# Altium project Send_Medicine_Motor.PrjPcb
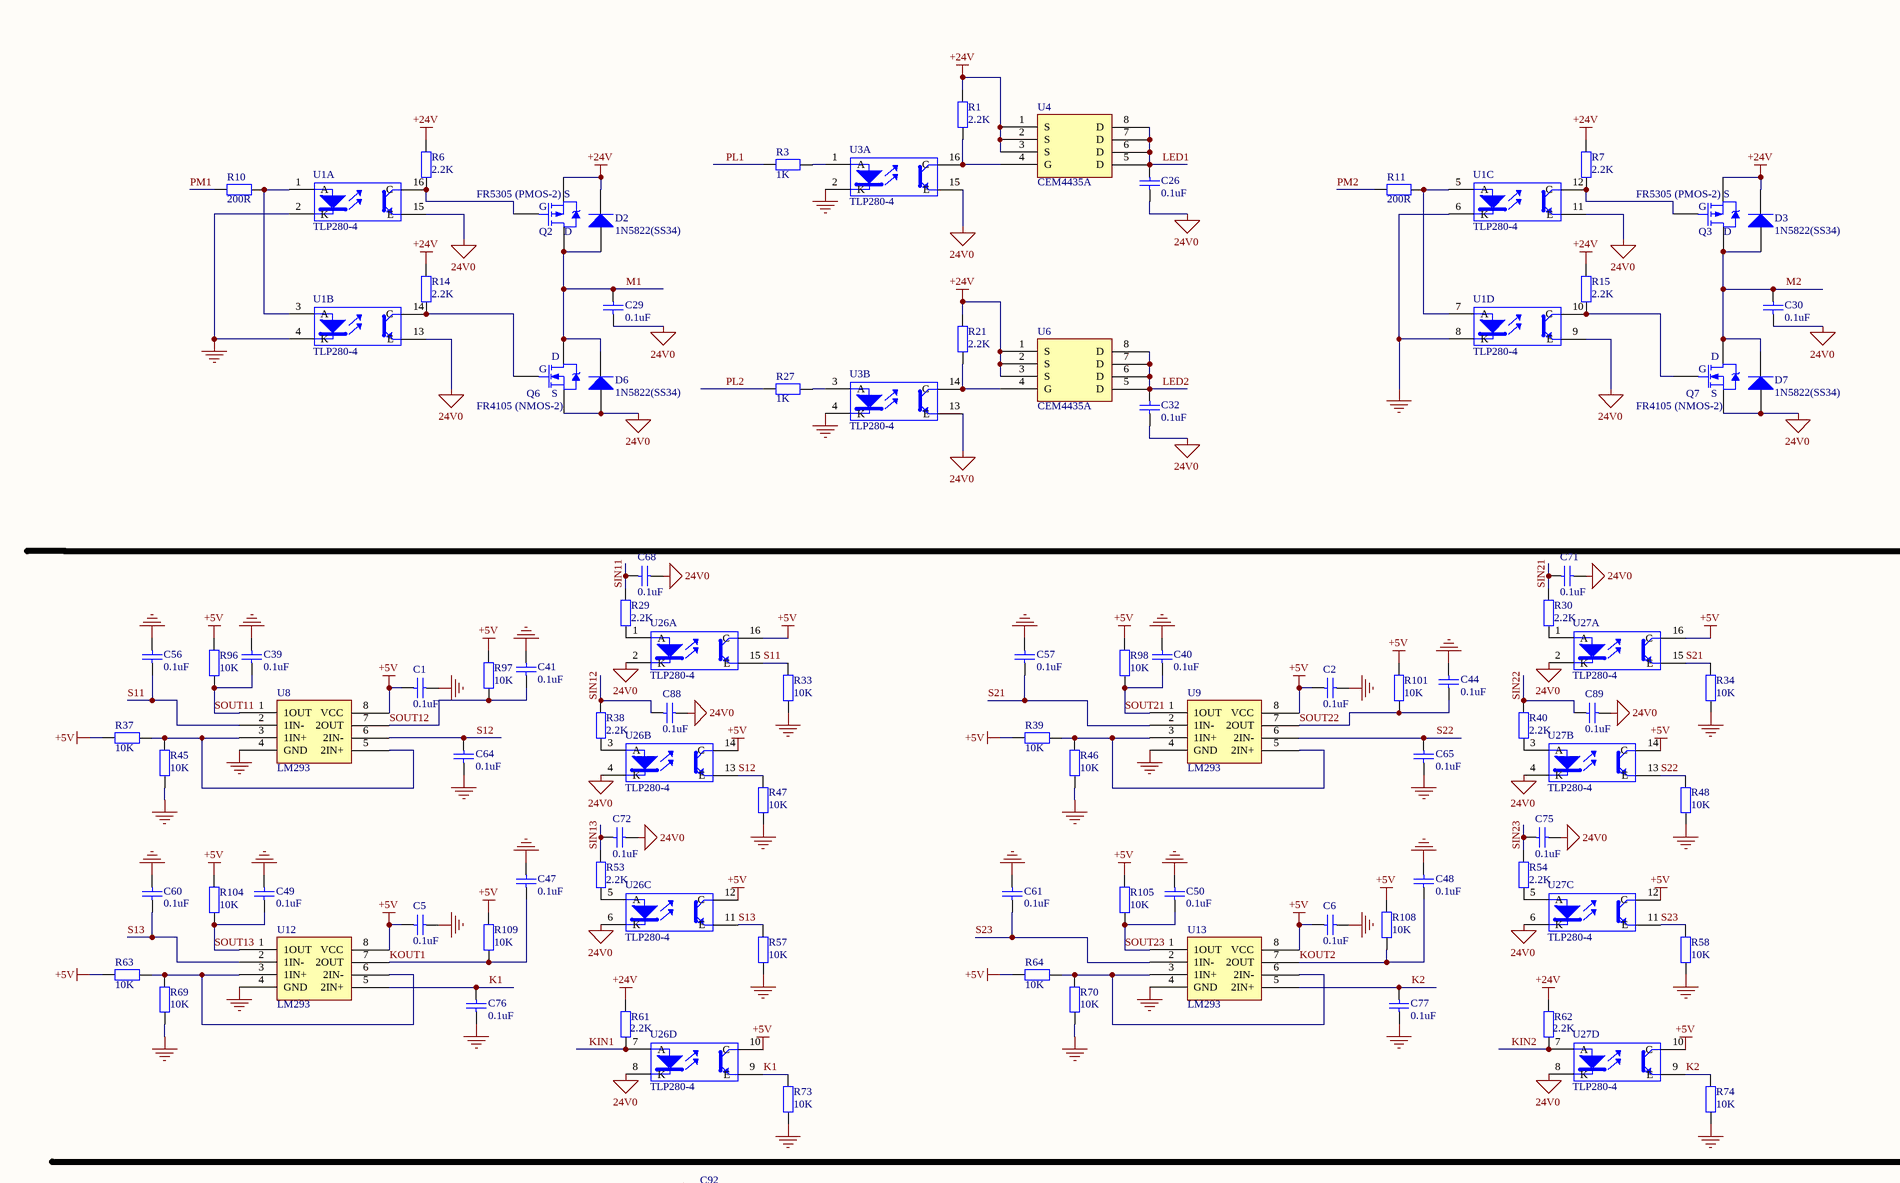
[diagram p0: Send_Medicine_Motor.SchDoc, top left]
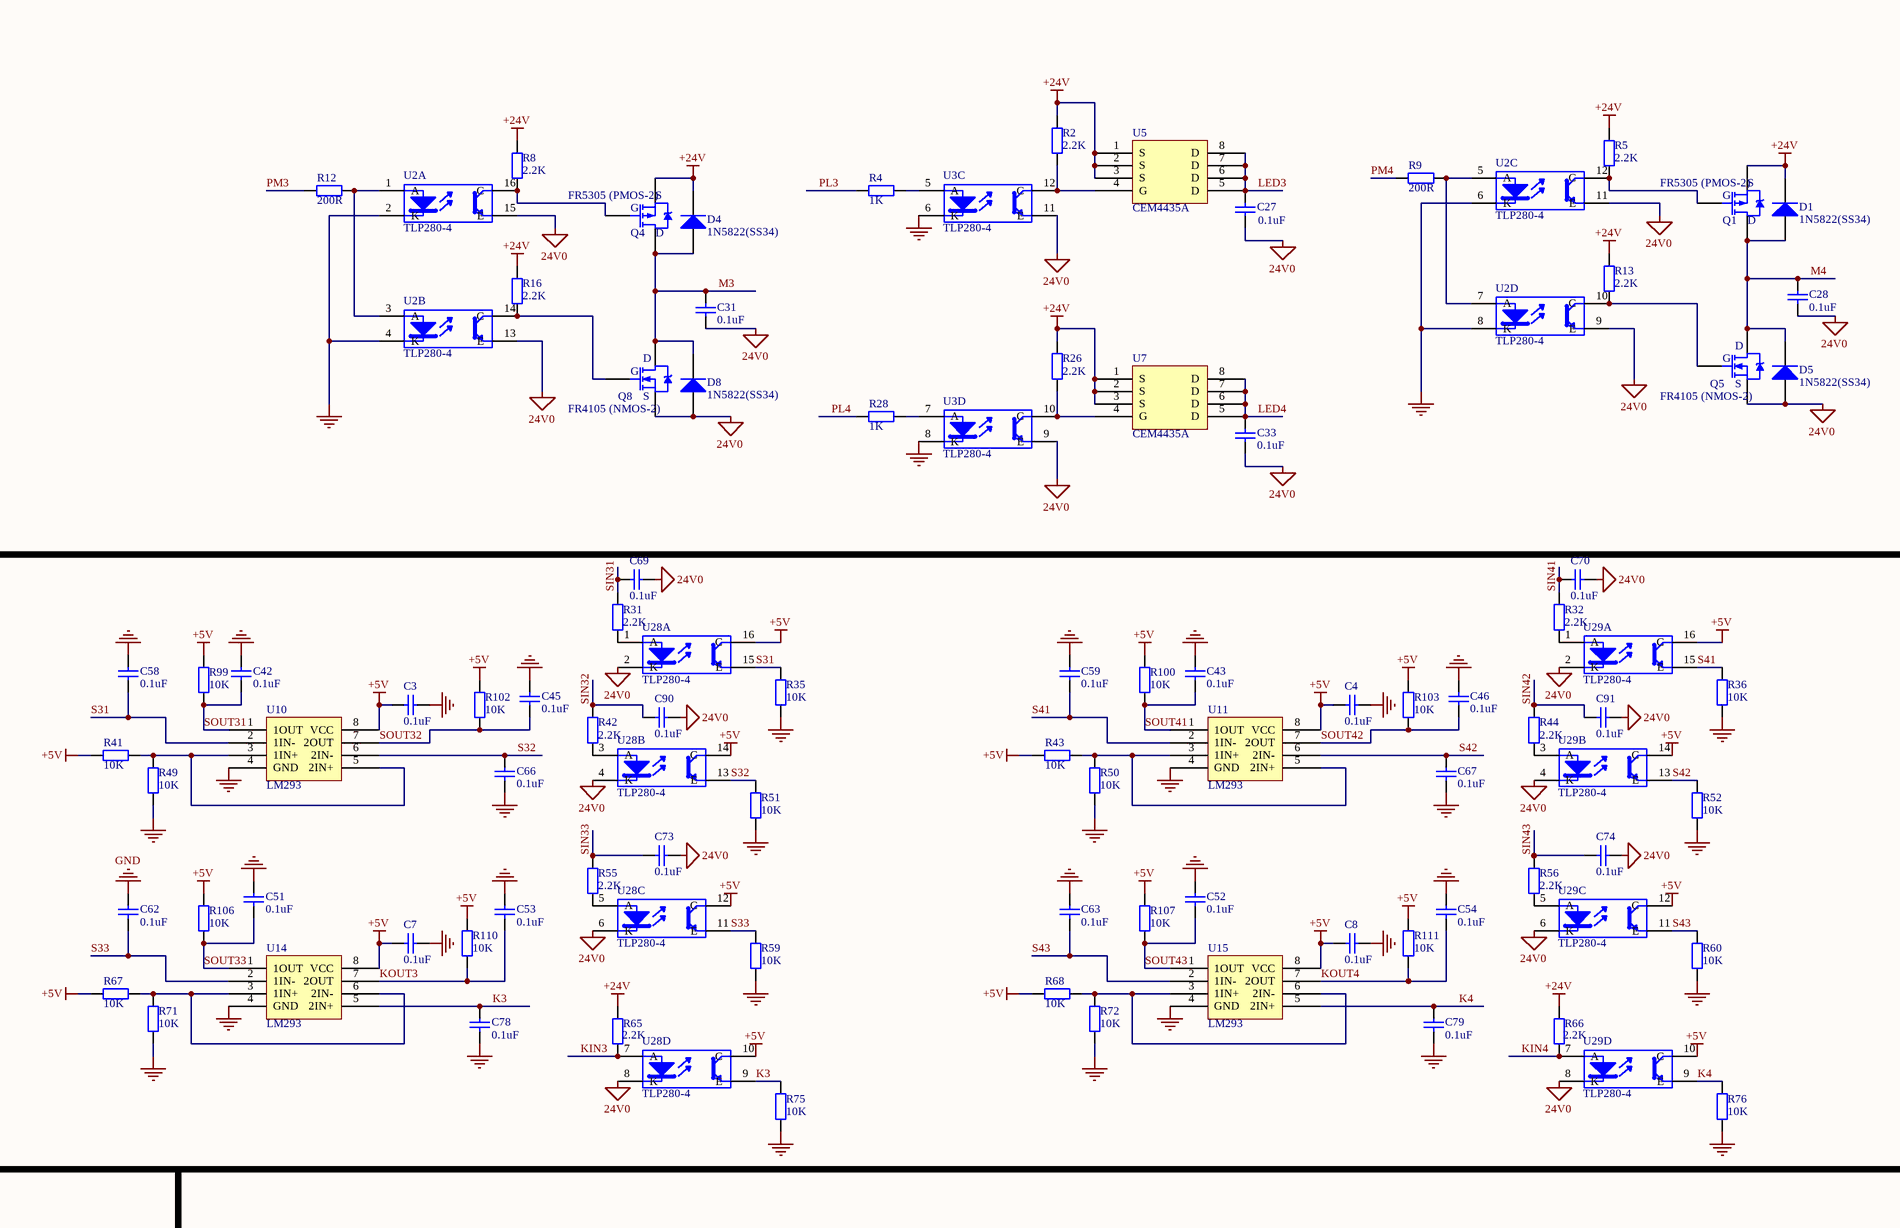
[diagram p1: Send_Medicine_Motor.SchDoc, top middle]
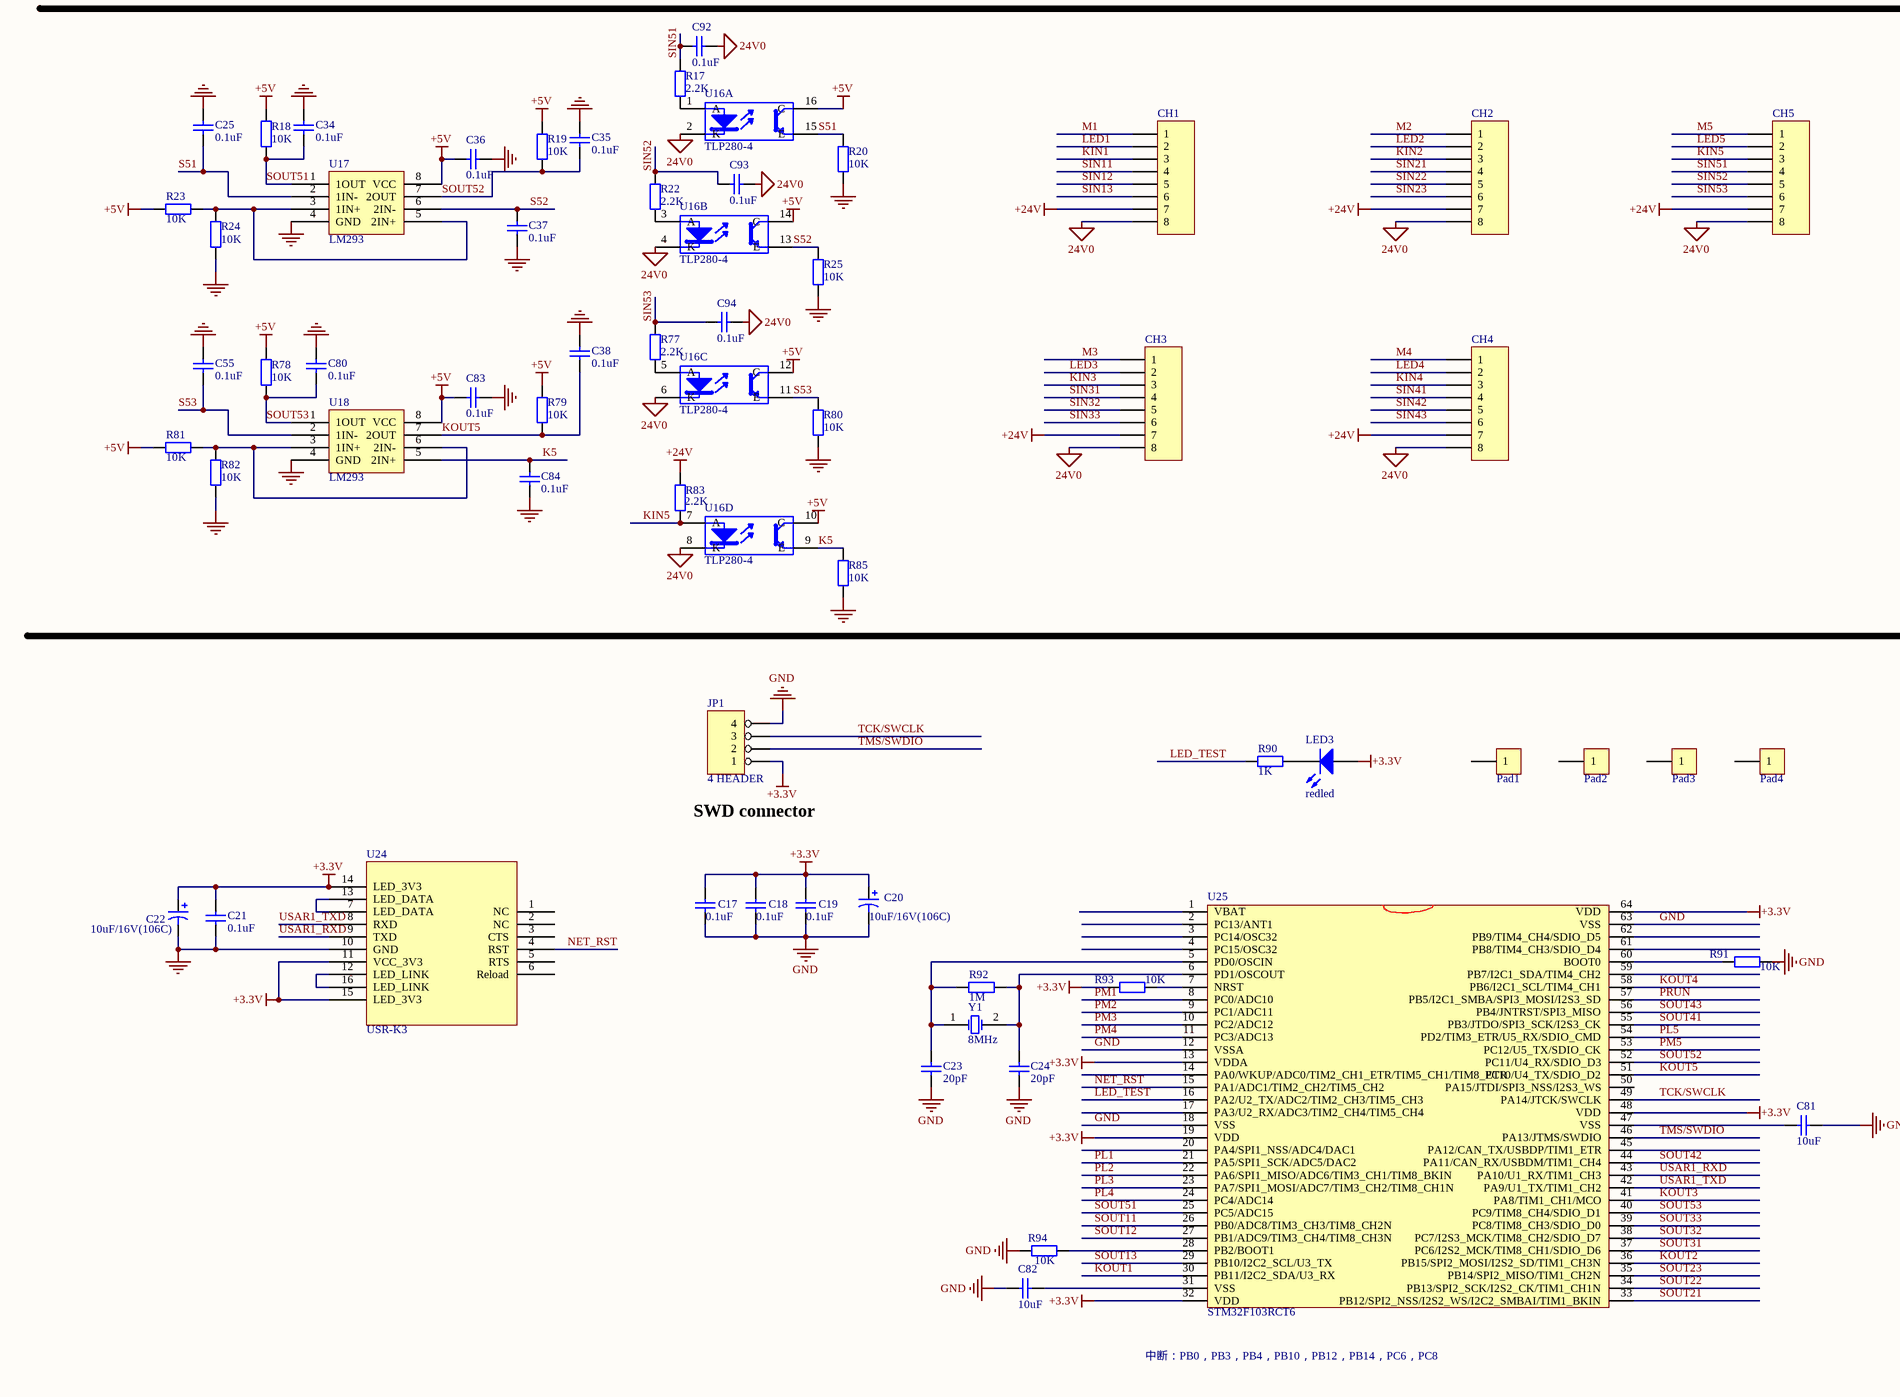
[diagram p2: Send_Medicine_Motor.SchDoc, bottom left]
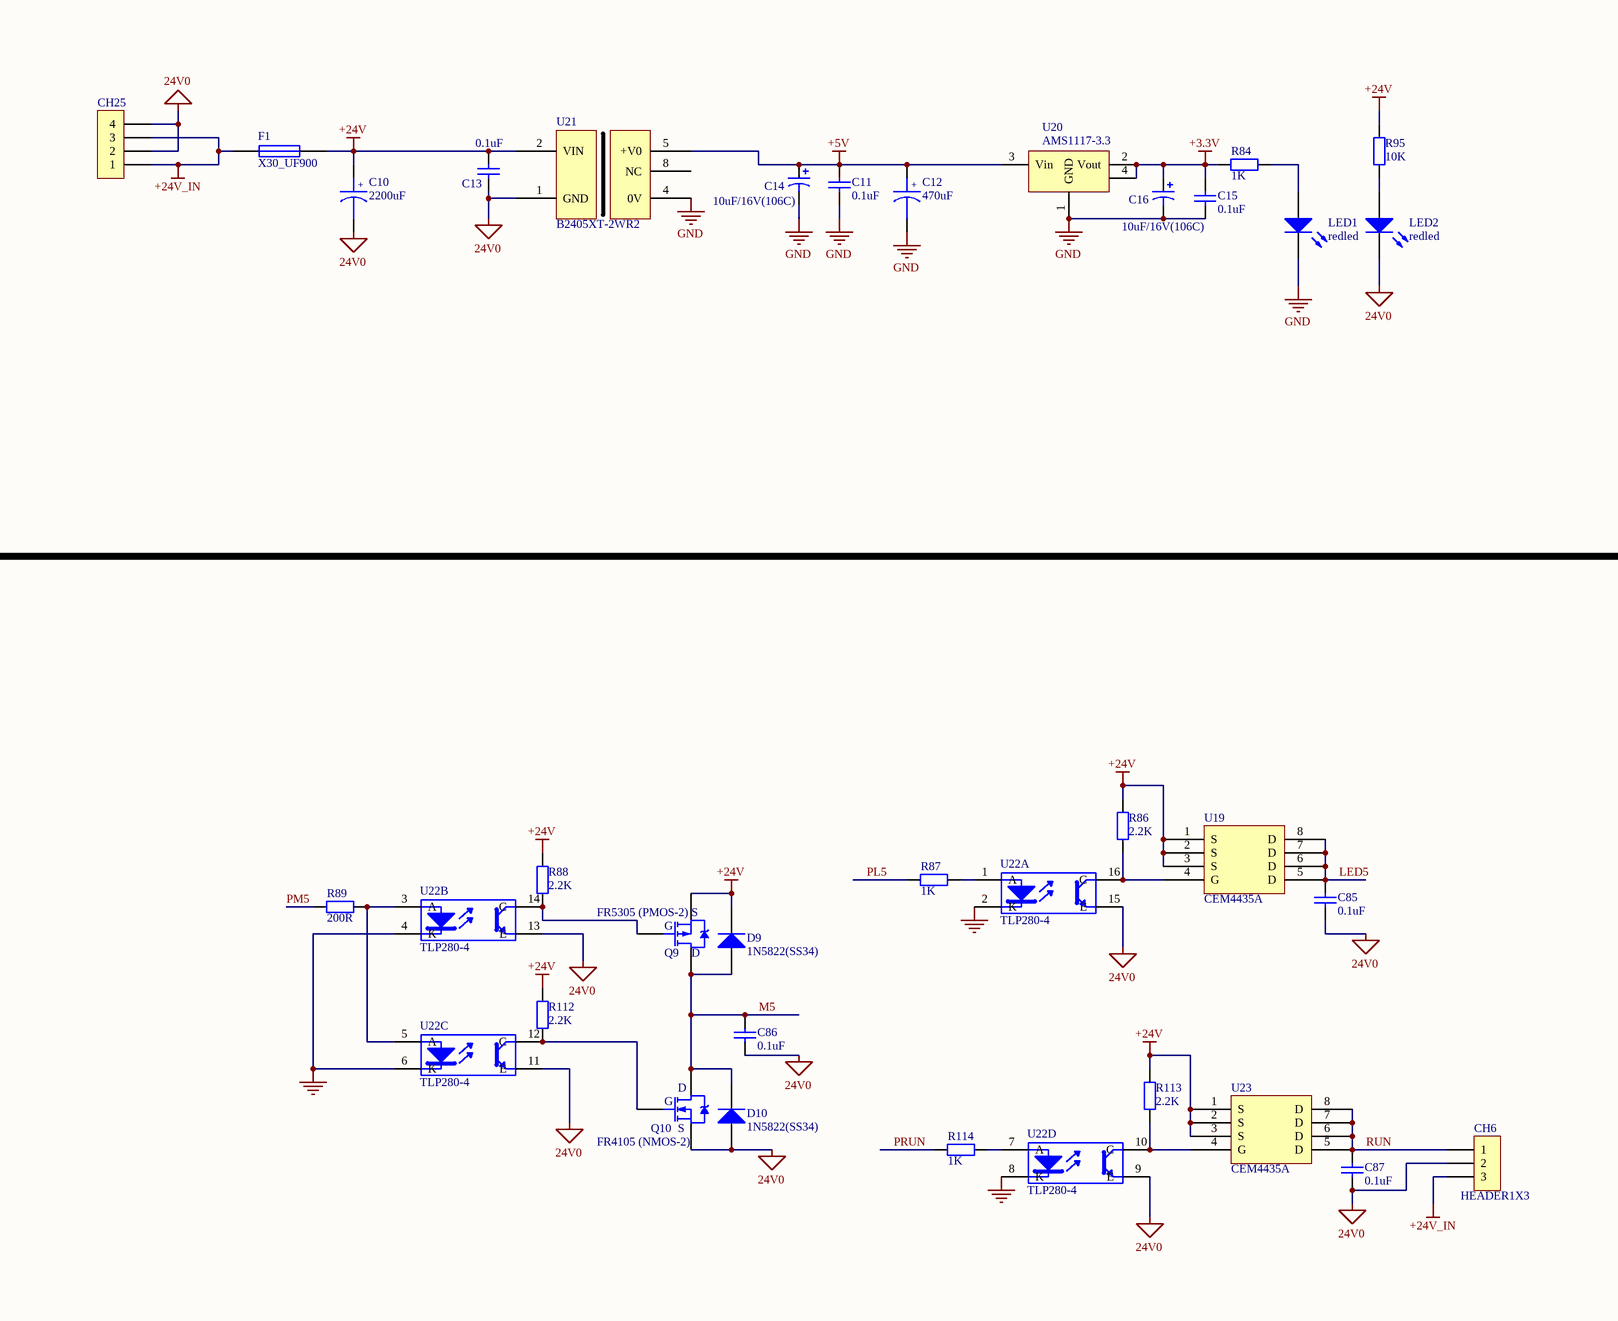
[diagram p3: Send_Medicine_Motor.SchDoc, bottom middle]
1 sheet, 273 parts. Net scope: global (net labels, ports and power ports of the same name join across sheets).
Board file: Send_Medicine_Motor.PcbDoc

## Sheet Send_Medicine_Motor.SchDoc
size A1

### Parts
C1  0.1uF  [0805]
C2  0.1uF  [0805]
C3  0.1uF  [0805]
C4  0.1uF  [0805]
C5  0.1uF  [0805]
C6  0.1uF  [0805]
C7  0.1uF  [0805]
C8  0.1uF  [0805]
C10  2200uF  [C7.8*17]
C11  0.1uF  [0805]
C12  470uF  [C5*10]
C13  0.1uF  [0805]
C14  10uF/16V(106C)  [CAP A-3216]
C15  0.1uF  [0805]
C16  10uF/16V(106C)  [CAP A-3216]
C17  0.1uF  [0805]
C18  0.1uF  [0805]
C19  0.1uF  [0805]
C20  10uF/16V(106C)  [CAP A-3216]
C21  0.1uF  [0805]
C22  10uF/16V(106C)  [CAP A-3216]
C23  20pF  [0805]
C24  20pF  [0805]
C25  0.1uF  [0805]
C26  0.1uF  [0805]
C27  0.1uF  [0805]
C28  0.1uF  [0805]
C29  0.1uF  [0805]
C30  0.1uF  [0805]
C31  0.1uF  [0805]
C32  0.1uF  [0805]
C33  0.1uF  [0805]
C34  0.1uF  [0805]
C35  0.1uF  [0805]
C36  0.1uF  [0805]
C37  0.1uF  [0805]
C38  0.1uF  [0805]
C39  0.1uF  [0805]
C40  0.1uF  [0805]
C41  0.1uF  [0805]
C42  0.1uF  [0805]
C43  0.1uF  [0805]
C44  0.1uF  [0805]
C45  0.1uF  [0805]
C46  0.1uF  [0805]
C47  0.1uF  [0805]
C48  0.1uF  [0805]
C49  0.1uF  [0805]
C50  0.1uF  [0805]
C51  0.1uF  [0805]
C52  0.1uF  [0805]
C53  0.1uF  [0805]
C54  0.1uF  [0805]
C55  0.1uF  [0805]
C56  0.1uF  [0805]
C57  0.1uF  [0805]
C58  0.1uF  [0805]
C59  0.1uF  [0805]
C60  0.1uF  [0805]
C61  0.1uF  [0805]
C62  0.1uF  [0805]
C63  0.1uF  [0805]
C64  0.1uF  [0805]
C65  0.1uF  [0805]
C66  0.1uF  [0805]
C67  0.1uF  [0805]
C68  0.1uF  [0805]
C69  0.1uF  [0805]
C70  0.1uF  [0805]
C71  0.1uF  [0805]
C72  0.1uF  [0805]
C73  0.1uF  [0805]
C74  0.1uF  [0805]
C75  0.1uF  [0805]
C76  0.1uF  [0805]
C77  0.1uF  [0805]
C78  0.1uF  [0805]
C79  0.1uF  [0805]
C80  0.1uF  [0805]
C81  10uF  [0805]
C82  10uF  [0805]
C83  0.1uF  [0805]
C84  0.1uF  [0805]
C85  0.1uF  [0805]
C86  0.1uF  [0805]
C87  0.1uF  [0805]
C88  0.1uF  [0805]
C89  0.1uF  [0805]
C90  0.1uF  [0805]
C91  0.1uF  [0805]
C92  0.1uF  [0805]
C93  0.1uF  [0805]
C94  0.1uF  [0805]
CH1  HEADER1X8  [CH3.96-8PIN]  (value not drawn)
CH2  HEADER1X8  [CH3.96-8PIN]  (value not drawn)
CH3  HEADER1X8  [CH3.96-8PIN]  (value not drawn)
CH4  HEADER1X8  [CH3.96-8PIN]  (value not drawn)
CH5  HEADER1X8  [CH3.96-8PIN]  (value not drawn)
CH6  HEADER1X3  [CH3.96-3PIN]
CH25  HEADER1X4  [CH3.96-4PIN]  (value not drawn)
D1  1N5822(SS34)  [SMA]
D2  1N5822(SS34)  [SMA]
D3  1N5822(SS34)  [SMA]
D4  1N5822(SS34)  [SMA]
D5  1N5822(SS34)  [SMA]
D6  1N5822(SS34)  [SMA]
D7  1N5822(SS34)  [SMA]
D8  1N5822(SS34)  [SMA]
D9  1N5822(SS34)  [SMA]
D10  1N5822(SS34)  [SMA]
F1  X30_UF900  [X30UF900]
JP1  4 HEADER  [CON4_1.5]
LED1  redled  [LED-0805]
LED2  redled  [LED-0805]
LED3  redled  [LED-0805]
Pad1  Pad  [pad35]  (value not drawn)
Pad2  Pad  [pad35]  (value not drawn)
Pad3  Pad  [pad35]  (value not drawn)
Pad4  Pad  [pad35]  (value not drawn)
Q1  FR5305 (PMOS-2)  [TO-252]
Q2  FR5305 (PMOS-2)  [TO-252]
Q3  FR5305 (PMOS-2)  [TO-252]
Q4  FR5305 (PMOS-2)  [TO-252]
Q5  FR4105 (NMOS-2)  [TO-252]
Q6  FR4105 (NMOS-2)  [TO-252]
Q7  FR4105 (NMOS-2)  [TO-252]
Q8  FR4105 (NMOS-2)  [TO-252]
Q9  FR5305 (PMOS-2)  [TO-252]
Q10  FR4105 (NMOS-2)  [TO-252]
R1  2.2K  [0805]
R2  2.2K  [0805]
R3  1K  [0805]
R4  1K  [0805]
R5  2.2K  [0805]
R6  2.2K  [0805]
R7  2.2K  [0805]
R8  2.2K  [0805]
R9  200R  [0805]
R10  200R  [0805]
R11  200R  [0805]
R12  200R  [0805]
R13  2.2K  [0805]
R14  2.2K  [0805]
R15  2.2K  [0805]
R16  2.2K  [0805]
R17  2.2K  [0805]
R18  10K  [0805]
R19  10K  [0805]
R20  10K  [0805]
R21  2.2K  [0805]
R22  2.2K  [0805]
R23  10K  [0805]
R24  10K  [0805]
R25  10K  [0805]
R26  2.2K  [0805]
R27  1K  [0805]
R28  1K  [0805]
R29  2.2K  [0805]
R30  2.2K  [0805]
R31  2.2K  [0805]
R32  2.2K  [0805]
R33  10K  [0805]
R34  10K  [0805]
R35  10K  [0805]
R36  10K  [0805]
R37  10K  [0805]
R38  2.2K  [0805]
R39  10K  [0805]
R40  2.2K  [0805]
R41  10K  [0805]
R42  2.2K  [0805]
R43  10K  [0805]
R44  2.2K  [0805]
R45  10K  [0805]
R46  10K  [0805]
R47  10K  [0805]
R48  10K  [0805]
R49  10K  [0805]
R50  10K  [0805]
R51  10K  [0805]
R52  10K  [0805]
R53  2.2K  [0805]
R54  2.2K  [0805]
R55  2.2K  [0805]
R56  2.2K  [0805]
R57  10K  [0805]
R58  10K  [0805]
R59  10K  [0805]
R60  10K  [0805]
R61  2.2K  [0805]
R62  2.2K  [0805]
R63  10K  [0805]
R64  10K  [0805]
R65  2.2K  [0805]
R66  2.2K  [0805]
R67  10K  [0805]
R68  10K  [0805]
R69  10K  [0805]
R70  10K  [0805]
R71  10K  [0805]
R72  10K  [0805]
R73  10K  [0805]
R74  10K  [0805]
R75  10K  [0805]
R76  10K  [0805]
R77  2.2K  [0805]
R78  10K  [0805]
R79  10K  [0805]
R80  10K  [0805]
R81  10K  [0805]
R82  10K  [0805]
R83  2.2K  [0805]
R84  1K  [0805]
R85  10K  [0805]
R86  2.2K  [0805]
R87  1K  [0805]
R88  2.2K  [0805]
R89  200R  [0805]
R90  1K  [0805]
R91  10K  [0805]
R92  1M  [0805]
R93  10K  [0805]
R94  10K  [0805]
R95  10K  [0805]
R96  10K  [0805]
R97  10K  [0805]
R98  10K  [0805]
R99  10K  [0805]
R100  10K  [0805]
R101  10K  [0805]
R102  10K  [0805]
R103  10K  [0805]
R104  10K  [0805]
R105  10K  [0805]
R106  10K  [0805]
R107  10K  [0805]
R108  10K  [0805]
R109  10K  [0805]
R110  10K  [0805]
R111  10K  [0805]
R112  2.2K  [0805]
R113  2.2K  [0805]
R114  1K  [0805]
U1  TLP280-4  [SO16]  (parts A,B,C,D of 4)
U2  TLP280-4  [SO16]  (parts A,B,C,D of 4)
U3  TLP280-4  [SO16]  (parts A,B,C,D of 4)
U4  CEM4435A  [SOP8-OP27]
U5  CEM4435A  [SOP8-OP27]
U6  CEM4435A  [SOP8-OP27]
U7  CEM4435A  [SOP8-OP27]
U8  LM293  [SOP8-OP27]
U9  LM293  [SOP8-OP27]
U10  LM293  [SOP8-OP27]
U11  LM293  [SOP8-OP27]
U12  LM293  [SOP8-OP27]
U13  LM293  [SOP8-OP27]
U14  LM293  [SOP8-OP27]
U15  LM293  [SOP8-OP27]
U16  TLP280-4  [SO16]  (parts A,B,C,D of 4)
U17  LM293  [SOP8-OP27]
U18  LM293  [SOP8-OP27]
U19  CEM4435A  [SOP8-OP27]
U20  AMS1117-3.3  [SOT223]
U21  B2405XT-2WR2  [B2405XT-2WR2]
U22  TLP280-4  [SO16]  (parts A,B,C,D of 4)
U23  CEM4435A  [SOP8-OP27]
U24  USR-K3  [USR-K3]
U25  STM32F103RCT6  [LQFP64]
U26  TLP280-4  [SO16]  (parts A,B,C,D of 4)
U27  TLP280-4  [SO16]  (parts A,B,C,D of 4)
U28  TLP280-4  [SO16]  (parts A,B,C,D of 4)
U29  TLP280-4  [SO16]  (parts A,B,C,D of 4)
Y1  8MHz  [XTAL_US]

### Nets
24V0: C10.2 C13.1 C26.2 C27.2 C28.2 C29.2 C30.2 C31.2 C32.2 C33.2 C68.1 C69.2 C70.2 C71.2 C72.1 C73.2 C74.2 C75.2 C85.2 C86.2 C87.2 C88.1 C89.1 C90.1 C91.1 C92.1 C93.1 C94.1 CH1.8 CH2.8 CH3.8 CH4.8 CH5.8 CH6.2 CH25.2 CH25.4 D5.1(A) D6.1(A) D7.1(A) D8.1(A) D10.1(A) LED2.2(K) Q5.3(S) Q6.3(S) Q7.3(S) Q8.3(S) Q10.3(S) U1.9(E) U1.11(E) U1.13(E) U1.15(E) U2.9(E) U2.11(E) U2.13(E) U2.15(E) U3.9(E) U3.11(E) U3.13(E) U3.15(E) U16.2(K) U16.4(K) U16.6(K) U16.8(K) U21.1(GND) U22.9(E) U22.11(E) U22.13(E) U22.15(E) U26.2(K) U26.4(K) U26.6(K) U26.8(K) U27.2(K) U27.4(K) U27.6(K) U27.8(K) U28.2(K) U28.4(K) U28.6(K) U28.8(K) U29.2(K) U29.4(K) U29.6(K) U29.8(K)
+3.3V: C15.2 C16.1 C17.2 C18.2 C19.2 C20.1 C21.2 C22.1 JP1.1 LED3.1(A) R84.2 R93.1 U20.2(Vout) U20.4 U24.11(VCC_3V3) U24.14(LED_3V3) U24.15(LED_3V3) U25.13(VDDA) U25.19(VDD) U25.32(VDD) U25.48(VDD) U25.64(VDD)
+5V: C1.2 C2.2 C3.2 C4.2 C5.2 C6.2 C7.2 C8.2 C11.2 C12.1 C14.1 C36.2 C83.2 R18.1 R19.1 R23.1 R37.1 R39.1 R41.1 R43.1 R63.1 R64.1 R67.1 R68.1 R78.1 R79.1 R81.1 R96.1 R97.1 R98.1 R99.1 R100.1 R101.1 R102.1 R103.1 R104.1 R105.1 R106.1 R107.1 R108.1 R109.1 R110.1 R111.1 U8.8(VCC) U9.8(VCC) U10.8(VCC) U11.8(VCC) U12.8(VCC) U13.8(VCC) U14.8(VCC) U15.8(VCC) U16.10(C) U16.12(C) U16.14(C) U16.16(C) U17.8(VCC) U18.8(VCC) U20.3(Vin) U21.5(+V0) U26.10(C) U26.12(C) U26.14(C) U26.16(C) U27.10(C) U27.12(C) U27.14(C) U27.16(C) U28.10(C) U28.12(C) U28.14(C) U28.16(C) U29.10(C) U29.12(C) U29.14(C) U29.16(C)
+24V: C10.1 C13.2 CH1.7 CH2.7 CH3.7 CH4.7 CH5.7 D1.2(K) D2.2(K) D3.2(K) D4.2(K) D9.2(K) F1.2 Q1.3(S) Q2.3(S) Q3.3(S) Q4.3(S) Q9.3(S) R1.2 R2.2 R5.2 R6.2 R7.2 R8.2 R13.2 R14.2 R15.2 R16.2 R21.2 R26.2 R61.1 R62.1 R65.1 R66.1 R83.1 R86.2 R88.2 R95.2 R112.2 R113.2 U4.1(S) U4.2(S) U4.3(S) U5.1(S) U5.2(S) U5.3(S) U6.1(S) U6.2(S) U6.3(S) U7.1(S) U7.2(S) U7.3(S) U19.1(S) U19.2(S) U19.3(S) U21.2(VIN) U23.1(S) U23.2(S) U23.3(S)
+24V_IN: CH6.3 CH25.1 CH25.3 F1.1
GND: C1.1 C2.1 C3.1 C4.1 C5.1 C6.1 C7.1 C8.1 C11.1 C12.2 C14.2 C15.1 C16.2 C17.1 C18.1 C19.1 C20.2 C21.1 C22.2 C23.1 C24.1 C25.1 C34.1 C35.1 C36.1 C37.1 C38.1 C39.1 C40.1 C41.1 C42.1 C43.1 C44.1 C45.1 C46.1 C47.1 C48.1 C49.1 C50.1 C51.1 C52.1 C53.1 C54.1 C55.1 C56.1 C57.1 C58.1 C59.1 C60.1 C61.1 C62.1 C63.1 C64.1 C65.1 C66.1 C67.1 C76.1 C77.1 C78.1 C79.1 C80.1 C81.2 C82.1 C83.1 C84.1 JP1.4 LED1.2(K) R20.2 R24.2 R25.2 R33.2 R34.2 R35.2 R36.2 R45.2 R46.2 R47.2 R48.2 R49.2 R50.2 R51.2 R52.2 R57.2 R58.2 R59.2 R60.2 R69.2 R70.2 R71.2 R72.2 R73.2 R74.2 R75.2 R76.2 R80.2 R82.2 R85.2 R91.1 R94.1 U1.2(K) U1.4(K) U1.6(K) U1.8(K) U2.2(K) U2.4(K) U2.6(K) U2.8(K) U3.2(K) U3.4(K) U3.6(K) U3.8(K) U8.4(GND) U9.4(GND) U10.4(GND) U11.4(GND) U12.4(GND) U13.4(GND) U14.4(GND) U15.4(GND) U17.4(GND) U18.4(GND) U20.1(GND) U21.4(0V) U22.2(K) U22.4(K) U22.6(K) U22.8(K) U24.10(GND) U25.12(VSSA) U25.18(VSS) U25.63(VSS)
K1: C76.2 R73.1 U12.5(2IN+) U26.9(E)
K2: C77.2 R74.1 U13.5(2IN+) U27.9(E)
K3: C78.2 R75.1 U14.5(2IN+) U28.9(E)
K4: C79.2 R76.1 U15.5(2IN+) U29.9(E)
K5: C84.2 R85.1 U16.9(E) U18.5(2IN+)
KIN1: CH1.3 R61.2 U26.7(A)
KIN2: CH2.3 R62.2 U27.7(A)
KIN3: CH3.3 R65.2 U28.7(A)
KIN4: CH4.3 R66.2 U29.7(A)
KIN5: CH5.3 R83.2 U16.7(A)
KOUT1: C47.2 R109.2 U12.7(2OUT) U25.30(PB11/I2C2_SDA/U3_RX)
KOUT2: C48.2 R108.2 U13.7(2OUT) U25.36(PB15/SPI2_MOSI/I2S2_SD/TIM1_CH3N)
KOUT3: C53.2 R110.2 U14.7(2OUT) U25.41(PA8/TIM1_CH1/MCO)
KOUT4: C54.2 R111.2 U15.7(2OUT) U25.58(PB6/I2C1_SCL/TIM4_CH1)
KOUT5: C38.2 R79.2 U18.7(2OUT) U25.51(PC10/U4_TX/SDIO_D2)
LED1: C26.1 CH1.2 U4.5(D) U4.6(D) U4.7(D) U4.8(D)
LED2: C32.1 CH2.2 U6.5(D) U6.6(D) U6.7(D) U6.8(D)
LED3: C27.1 CH3.2 U5.5(D) U5.6(D) U5.7(D) U5.8(D)
LED4: C33.1 CH4.2 U7.5(D) U7.6(D) U7.7(D) U7.8(D)
LED5: C85.1 CH5.2 U19.5(D) U19.6(D) U19.7(D) U19.8(D)
LED_TEST: R90.1 U25.16(PA2/U2_TX/ADC2/TIM2_CH3/TIM5_CH3)
M1: C29.1 CH1.1 D2.1(A) D6.2(K) Q2.2(D) Q6.2(D)
M2: C30.1 CH2.1 D3.1(A) D7.2(K) Q3.2(D) Q7.2(D)
M3: C31.1 CH3.1 D4.1(A) D8.2(K) Q4.2(D) Q8.2(D)
M4: C28.1 CH4.1 D1.1(A) D5.2(K) Q1.2(D) Q5.2(D)
M5: C86.1 CH5.1 D9.1(A) D10.2(K) Q9.2(D) Q10.2(D)
NET_RST: U24.4(RST) U25.15(PA1/ADC1/TIM2_CH2/TIM5_CH2)
PL1: R3.1 U25.21(PA5/SPI1_SCK/ADC5/DAC2)
PL2: R27.1 U25.22(PA6/SPI1_MISO/ADC6/TIM3_CH1/TIM8_BKIN)
PL3: R4.1 U25.23(PA7/SPI1_MOSI/ADC7/TIM3_CH2/TIM8_CH1N)
PL4: R28.1 U25.24(PC4/ADC14)
PL5: R87.1 U25.54(PD2/TIM3_ETR/U5_RX/SDIO_CMD)
PM1: R10.1 U25.8(PC0/ADC10)
PM2: R11.1 U25.9(PC1/ADC11)
PM3: R12.1 U25.10(PC2/ADC12)
PM4: R9.1 U25.11(PC3/ADC13)
PM5: R89.1 U25.53(PC12/U5_TX/SDIO_CK)
PRUN: R114.1 U25.57(PB5/I2C1_SMBA/SPI3_MOSI/I2S3_SD)
RUN: C87.1 CH6.1 U23.5(D) U23.6(D) U23.7(D) U23.8(D)
S11: C56.2 R33.1 U8.2(1IN-) U26.15(E)
S12: C64.2 R47.1 U8.6(2IN-) U26.13(E)
S13: C60.2 R57.1 U12.2(1IN-) U26.11(E)
S21: C57.2 R34.1 U9.2(1IN-) U27.15(E)
S22: C65.2 R48.1 U9.6(2IN-) U27.13(E)
S23: C61.2 R58.1 U13.2(1IN-) U27.11(E)
S31: C58.2 R35.1 U10.2(1IN-) U28.15(E)
S32: C66.2 R51.1 U10.6(2IN-) U28.13(E)
S33: C62.2 R59.1 U14.2(1IN-) U28.11(E)
S41: C59.2 R36.1 U11.2(1IN-) U29.15(E)
S42: C67.2 R52.1 U11.6(2IN-) U29.13(E)
S43: C63.2 R60.1 U15.2(1IN-) U29.11(E)
S51: C25.2 R20.1 U16.15(E) U17.2(1IN-)
S52: C37.2 R25.1 U16.13(E) U17.6(2IN-)
S53: C55.2 R80.1 U16.11(E) U18.2(1IN-)
SIN11: C68.2 CH1.4 R29.1
SIN12: C88.2 CH1.5 R38.1
SIN13: C72.2 CH1.6 R53.1
SIN21: C71.1 CH2.4 R30.1
SIN22: C89.2 CH2.5 R40.1
SIN23: C75.1 CH2.6 R54.1
SIN31: C69.1 CH3.4 R31.1
SIN32: C90.2 CH3.5 R42.1
SIN33: C73.1 CH3.6 R55.1
SIN41: C70.1 CH4.4 R32.1
SIN42: C91.2 CH4.5 R44.1
SIN43: C74.1 CH4.6 R56.1
SIN51: C92.2 CH5.4 R17.1
SIN52: C93.2 CH5.5 R22.1
SIN53: C94.2 CH5.6 R77.1
SOUT11: C39.2 R96.2 U8.1(1OUT) U25.26(PB0/ADC8/TIM3_CH3/TIM8_CH2N)
SOUT12: C41.2 R97.2 U8.7(2OUT) U25.27(PB1/ADC9/TIM3_CH4/TIM8_CH3N)
SOUT13: C49.2 R104.2 U12.1(1OUT) U25.29(PB10/I2C2_SCL/U3_TX)
SOUT21: C40.2 R98.2 U9.1(1OUT) U25.33(PB12/SPI2_NSS/I2S2_WS/I2C2_SMBAI/TIM1_BKIN)
SOUT22: C44.2 R101.2 U9.7(2OUT) U25.34(PB13/SPI2_SCK/I2S2_CK/TIM1_CH1N)
SOUT23: C50.2 R105.2 U13.1(1OUT) U25.35(PB14/SPI2_MISO/TIM1_CH2N)
SOUT31: C42.2 R99.2 U10.1(1OUT) U25.37(PC6/I2S2_MCK/TIM8_CH1/SDIO_D6)
SOUT32: C45.2 R102.2 U10.7(2OUT) U25.38(PC7/I2S3_MCK/TIM8_CH2/SDIO_D7)
SOUT33: C51.2 R106.2 U14.1(1OUT) U25.39(PC8/TIM8_CH3/SDIO_D0)
SOUT41: C43.2 R100.2 U11.1(1OUT) U25.55(PB3/JTDO/SPI3_SCK/I2S3_CK)
SOUT42: C46.2 R103.2 U11.7(2OUT) U25.44(PA11/CAN_RX/USBDM/TIM1_CH4)
SOUT43: C52.2 R107.2 U15.1(1OUT) U25.56(PB4/JNTRST/SPI3_MISO)
SOUT51: C34.2 R18.2 U17.1(1OUT) U25.25(PC5/ADC15)
SOUT52: C35.2 R19.2 U17.7(2OUT) U25.52(PC11/U4_RX/SDIO_D3)
SOUT53: C80.2 R78.2 U18.1(1OUT) U25.40(PC9/TIM8_CH4/SDIO_D1)
TCK/SWCLK: JP1.3 U25.49(PA14/JTCK/SWCLK)
TMS/SWDIO: JP1.2 U25.46(PA13/JTMS/SWDIO)
USAR1_RXD: U24.9(TXD) U25.43(PA10/U1_RX/TIM1_CH3)
USAR1_TXD: U24.8(RXD) U25.42(PA9/U1_TX/TIM1_CH2)
NetC23_2: C23.2 R92.1 U25.5(PD0/OSCIN) Y1.1(OSC1)
NetC24_2: C24.2 R92.2 U25.6(PD1/OSCOUT) Y1.2(OSC2)
NetC81_1: C81.1 U25.47(VSS)
NetC82_2: C82.2 U25.31(VSS)
NetLED1_1: LED1.1(A) R84.1
NetLED2_1: LED2.1(A) R95.1
NetLED3_2: LED3.2(K) R90.2
NetQ1_1: Q1.1(G) R5.1 U2.12(C)
NetQ2_1: Q2.1(G) R6.1 U1.16(C)
NetQ3_1: Q3.1(G) R7.1 U1.12(C)
NetQ4_1: Q4.1(G) R8.1 U2.16(C)
NetQ5_1: Q5.1(G) R13.1 U2.10(C)
NetQ6_1: Q6.1(G) R14.1 U1.14(C)
NetQ7_1: Q7.1(G) R15.1 U1.10(C)
NetQ8_1: Q8.1(G) R16.1 U2.14(C)
NetQ9_1: Q9.1(G) R88.1 U22.14(C)
NetQ10_1: Q10.1(G) R112.1 U22.12(C)
NetR1_1: R1.1 U3.16(C) U4.4(G)
NetR2_1: R2.1 U3.12(C) U5.4(G)
NetR3_2: R3.2 U3.1(A)
NetR4_2: R4.2 U3.5(A)
NetR9_2: R9.2 U2.5(A) U2.7(A)
NetR10_2: R10.2 U1.1(A) U1.3(A)
NetR11_2: R11.2 U1.5(A) U1.7(A)
NetR12_2: R12.2 U2.1(A) U2.3(A)
NetR17_2: R17.2 U16.1(A)
NetR21_1: R21.1 U3.14(C) U6.4(G)
NetR22_2: R22.2 U16.3(A)
NetR23_2: R23.2 R24.1 U17.3(1IN+) U17.5(2IN+)
NetR26_1: R26.1 U3.10(C) U7.4(G)
NetR27_2: R27.2 U3.3(A)
NetR28_2: R28.2 U3.7(A)
NetR29_2: R29.2 U26.1(A)
NetR30_2: R30.2 U27.1(A)
NetR31_2: R31.2 U28.1(A)
NetR32_2: R32.2 U29.1(A)
NetR37_2: R37.2 R45.1 U8.3(1IN+) U8.5(2IN+)
NetR38_2: R38.2 U26.3(A)
NetR39_2: R39.2 R46.1 U9.3(1IN+) U9.5(2IN+)
NetR40_2: R40.2 U27.3(A)
NetR41_2: R41.2 R49.1 U10.3(1IN+) U10.5(2IN+)
NetR42_2: R42.2 U28.3(A)
NetR43_2: R43.2 R50.1 U11.3(1IN+) U11.5(2IN+)
NetR44_2: R44.2 U29.3(A)
NetR53_2: R53.2 U26.5(A)
NetR54_2: R54.2 U27.5(A)
NetR55_2: R55.2 U28.5(A)
NetR56_2: R56.2 U29.5(A)
NetR63_2: R63.2 R69.1 U12.3(1IN+) U12.6(2IN-)
NetR64_2: R64.2 R70.1 U13.3(1IN+) U13.6(2IN-)
NetR67_2: R67.2 R71.1 U14.3(1IN+) U14.6(2IN-)
NetR68_2: R68.2 R72.1 U15.3(1IN+) U15.6(2IN-)
NetR77_2: R77.2 U16.5(A)
NetR81_2: R81.2 R82.1 U18.3(1IN+) U18.6(2IN-)
NetR86_1: R86.1 U19.4(G) U22.16(C)
NetR87_2: R87.2 U22.1(A)
NetR89_2: R89.2 U22.3(A) U22.5(A)
NetR91_2: R91.2 U25.60(BOOT0)
NetR93_2: R93.2 U25.7(NRST)
NetR94_2: R94.2 U25.28(PB2/BOOT1)
NetR113_1: R113.1 U22.10(C) U23.4(G)
NetR114_2: R114.2 U22.7(A)
NetU24_7: U24.7(LED_DATA) U24.13(LED_DATA)
NetU24_12: U24.12(LED_LINK) U24.16(LED_LINK)

Not connected (* = marked no-connect by the designer): Pad1 1; Pad2 1; Pad3 1; Pad4 1; U21 8(NC); U24 1(NC) 2(NC) 3(CTS) 5(RTS) 6(Reload); U25 1(VBAT) 2(PC13/ANT1) 3(PC14/OSC32) 4(PC15/OSC32) 14(PA0/WKUP/ADC0/TIM2_CH1_ETR/TIM5_CH1/TIM8_ETR) 17(PA3/U2_RX/ADC3/TIM2_CH4/TIM5_CH4) 20(PA4/SPI1_NSS/ADC4/DAC1) 45(PA12/CAN_TX/USBDP/TIM1_ETR) 50(PA15/JTDI/SPI3_NSS/I2S3_WS) 59(PB7/I2C1_SDA/TIM4_CH2) 61(PB8/TIM4_CH3/SDIO_D4) 62(PB9/TIM4_CH4/SDIO_D5)

### Notes on the sheet
- (near Q1) S
- (near Q2) G
- (near Q2) S
- (near Q2) D
- (near Q3) G
- (near Q3) S
- (near Q3) D
- (near Q4) G
- (near Q4) S
- (near Q4) D
- (near Q1) G
- (near Q1) D
- (near Q6) G
- (near Q6) D
- (near Q7) G
- (near Q7) D
- (near Q8) G
- (near Q8) D
- (near Q5) G
- (near Q5) D
- (near Q6) S
- (near Q7) S
- (near Q8) S
- (near Q5) S
- (near JP1) SWD connector
- (near Q9) S
- (near Q9) G
- (near Q9) D
- (near Q10) G
- (near Q10) D
- (near Q10) S
- 中断：PB0，PB3，PB4，PB10，PB12，PB14，PC6，PC8
- (in symbol C_2200uF) +

### Library data of the parts
C1-C8 C11 C13 C15 C17-C19 C21 C23-C94 = Cap: Capacitor; Published: 8-Jun-2000; LatestRevisionDate: 17-Jul-2002; LatestRevisionNote: Re-released for DXP Platform.; Publisher: Altium Limited
  C1-C8 C11 C13 C15 C17-C19 C21 C25-C80 C83-C94: PackageReference: RAD-0.3; Value: 0.1uF
  C23 C24: Value: 20pF
  C81 C82: PackageReference: RAD-0.3; Value: 10uF
C10 C12 = C_2200uF
C14 C16 C20 C22 = Cap Pol3: Polarized Capacitor (Surface Mount); Published: 8-Jun-2000; LatestRevisionDate: 17-Jul-2002; LatestRevisionNote: Re-released for DXP Platform.; PackageReference: C0805; Publisher: Altium Limited; Value: 10uF/16V(106C)
CH1-CH5 = HEADER1X8: Header, 8-Pin
D1-D10 = Diode 1N4148: High Conductance Fast Diode; Published: 8-Jun-2000; LatestRevisionDate: 17-Jul-2002; LatestRevisionNote: Re-released for DXP Platform.; DatasheetDocument: 1997; PackageReference: DO-35; Publisher: Altium Limited; Code_JEDEC: DO-204-AH; ComponentLink1Description: Manufacturer Link; ComponentLink1URL: http://www.fairchildsemi.com/; ComponentLink2Description: Datasheet; ComponentLink2URL: http://www.fairchildsemi.com/ds/1N%2F1N4148.pdf
F1 = Fuse 1: Fuse; Published: 8-Jun-2000; LatestRevisionDate: 17-Jul-2002; LatestRevisionNote: Re-released for DXP Platform.; PackageReference: PIN-W2/E2.8; Publisher: Altium Limited
JP1 = 4 HEADER: 4 Pin Header
LED1-LED3 = LED2: Typical RED, GREEN, YELLOW, AMBER GaAs LED; Published: 8-Jun-2000; LatestRevisionDate: 17-Jul-2002; LatestRevisionNote: Re-released for DXP Platform.; PackageDocument: Feb-2002; PackageReference: 3.2X1.6X1.1; Publisher: Altium Limited
Q1-Q4 Q9 = PMOS-2: P-Channel Power MOSFET; Note: Pin 4 not drawn and electrically connected to Pin 2.; Published: 8-Jun-2000; LatestRevisionDate: 17-Jul-2002; LatestRevisionNote: Re-released for DXP Platform.; DatasheetDocument: PD-9.390D; PackageReference: TO-220AB; Publisher: Altium Limited; Code_JEDEC: TO-220-AB; ComponentLink1Description: Manufacturer Link; ComponentLink1URL: http://www.irf.com/
Q5-Q8 Q10 = NMOS-2: N-Channel Power MOSFET; Note: Pin 2 is electrically connected to pin 4.; Published: 8-Jun-2000; LatestRevisionDate: 17-Jul-2002; LatestRevisionNote: Re-released for DXP Platform.; DatasheetDocument: PD-9.814; PackageReference: TO-220AB; Publisher: Altium Limited; Code_JEDEC: TO-220-AB; ComponentLink1Description: Manufacturer Link; ComponentLink1URL: http://www.irf.com/
R1-R114 = Res2: Resistor; Published: 8-Jun-2000; LatestRevisionDate: 17-Jul-2002; LatestRevisionNote: Re-released for DXP Platform.; Publisher: Altium Limited
  R1 R2 R5-R8 R13-R17 R21 R22 R26 R29-R32 R38 R40 R42 R44 R53-R56 R61 R62 R65 R66 R77 R83 R86 R88 R112 R113: PackageReference: AXIAL-0.4; Value: 2.2K
  R3 R4 R27 R28 R84 R87 R90 R114: PackageReference: AXIAL-0.4; Value: 1K
  R9-R12 R89: PackageReference: AXIAL-0.4; Value: 200R
  R18-R20 R23-R25 R33-R37 R39 R41 R43 R45-R52 R57-R60 R63 R64 R67-R76 R78-R82 R85 R95-R111: PackageReference: AXIAL-0.4; Value: 10K
  R91 R93 R94: Value: 10K
  R92: Value: 1M
U1-U3 U16 U22 U26-U29 = TLP521-4
U20 = AMS1117-5
U25 = STM32F103RDT6
Y1 = XTAL: Crystal Oscillator; Published: 8-Jun-2000; LatestRevisionDate: 17-Jul-2002; LatestRevisionNote: Re-released for DXP Platform.; Publisher: Altium Limited